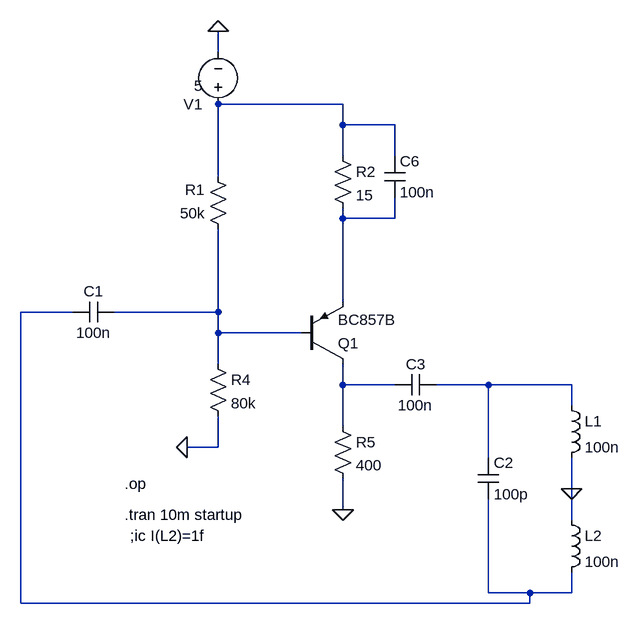
[diagram p0: schematic osc-hartley.asc]
osc-hartley.asc, the LTspice schematic file:
Version 4
SHEET 1 988 680
WIRE 0 -304 0 -336
WIRE 192 -224 0 -224
WIRE 192 -192 192 -224
WIRE 272 -192 192 -192
WIRE 192 -144 192 -192
WIRE 272 -144 272 -192
WIRE 0 -112 0 -224
WIRE 192 -48 192 -64
WIRE 272 -48 272 -80
WIRE 272 -48 192 -48
WIRE 192 80 192 -48
WIRE -224 96 -304 96
WIRE 0 96 0 -32
WIRE 0 96 -160 96
WIRE 0 128 0 96
WIRE 128 128 0 128
WIRE 0 176 0 128
WIRE 192 208 192 176
WIRE 272 208 192 208
WIRE 416 208 336 208
WIRE 544 208 416 208
WIRE 544 240 544 208
WIRE 192 272 192 208
WIRE 0 304 0 256
WIRE 0 304 -48 304
WIRE 416 320 416 208
WIRE 544 368 544 320
WIRE 192 400 192 352
WIRE 544 416 544 368
WIRE 416 528 416 384
WIRE 480 528 416 528
WIRE 544 528 544 496
WIRE 544 528 480 528
WIRE -304 544 -304 96
WIRE 480 544 480 528
WIRE 480 544 -304 544
FLAG 0 -336 0
FLAG -48 304 0
FLAG 544 368 0
FLAG 192 400 0
DATAFLAG 592 464 ""
DATAFLAG 192 -192 ""
DATAFLAG 80 128 ""
SYMBOL res 16 -16 R180
WINDOW 0 36 76 Left 2
WINDOW 3 36 40 Left 2
SYMATTR InstName R1
SYMATTR Value 50k
SYMBOL voltage 0 -208 R180
WINDOW 3 24 44 Left 2
WINDOW 123 0 0 Left 0
WINDOW 39 0 0 Left 0
SYMATTR Value 5
SYMATTR InstName V1
SYMBOL res -16 160 R0
SYMATTR InstName R4
SYMATTR Value 80k
SYMBOL res 176 -160 R0
SYMATTR InstName R2
SYMATTR Value 15
SYMBOL cap 256 -144 R0
SYMATTR InstName C6
SYMATTR Value 100n
SYMBOL res 176 256 R0
SYMATTR InstName R5
SYMATTR Value 400
SYMBOL cap -160 80 R90
WINDOW 0 0 32 VBottom 2
WINDOW 3 32 32 VTop 2
SYMATTR InstName C1
SYMATTR Value 100n
SYMBOL cap 400 320 R0
SYMATTR InstName C2
SYMATTR Value 100p
SYMBOL ind 528 224 R0
SYMATTR InstName L1
SYMATTR Value 100n
SYMBOL ind 528 400 R0
SYMATTR InstName L2
SYMATTR Value 100n
SYMBOL cap 336 192 R90
WINDOW 0 0 32 VBottom 2
WINDOW 3 32 32 VTop 2
SYMATTR InstName C3
SYMATTR Value 100n
SYMBOL pnp 128 176 M180
SYMATTR InstName Q1
SYMATTR Value BC857B
TEXT -144 360 Left 2 !.op
TEXT -144 408 Left 2 !.tran 10m startup
TEXT -136 440 Left 2 !;ic I(L2)=1f

The netlist it stands for:
* osc-hartley.asc
R1 N004 N001 50k
V1 N001 0 5
R4 N004 0 80k
R2 N001 N002 15
C6 N001 N002 100n
R5 N005 0 400
C1 N004 N003 100n
C2 N006 N003 100p
L1 N006 0 100n
L2 0 N003 100n
C3 N006 N005 100n
Q1 N005 N004 N002 0 BC857B
.model NPN NPN
.model PNP PNP
.lib standard.bjt
.op
.tran 10m startup
;ic I(L2)=1f
.backanno
.end